# Altium schematic sheet 10.SchDoc
size 297 x 209 mm
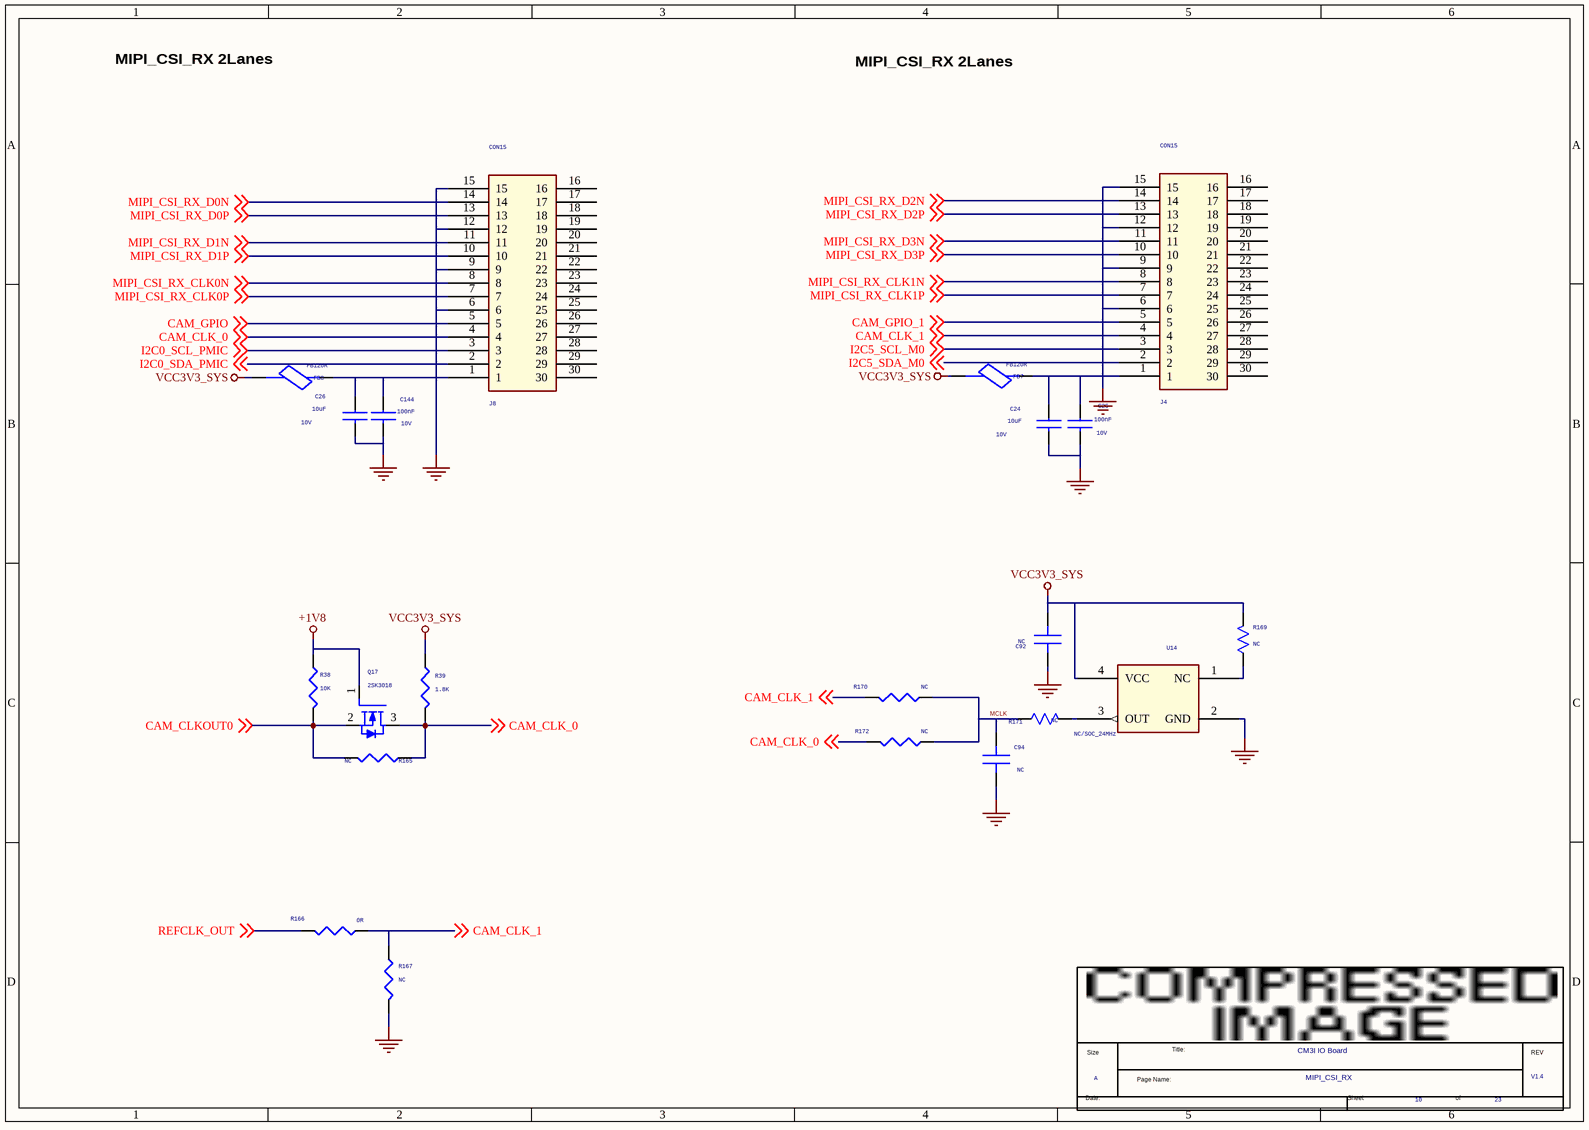
[diagram p0: 10.SchDoc]

## Parts
*  Page Count: 23  Page Number: 10  Page Size: A  Title: CM3I IO Board  RevCode: V1.4  Doc: MIPI_CSI_RX  (hidden comment: radxa_1010)  (graphical)
C24  10uF  Voltage: 10V  [C0603]
C25  100nF  Voltage: 10V  [C0402]
C26  10uF  Voltage: 10V  [C0603]
C92  NC  [C0402]
C94  NC  [C0402]
C144  100nF  Voltage: 10V  [C0402]
FB7  FB120R  [R0402]
FB8  FB120R  [R0402]
J4  CON15  [FPC15PIN-1.0MM-LS]
J8  CON15  [FPC15PIN-1.0MM-LS]
Q17  2SK3018  [SOT23]
R38  10K  [R0402]
R39  1.8K  [R0402]
R165  NC  [R0402]
R166  0R  [R0402]
R167  NC  [R0402]
R169  NC  [R0402]
R170  NC  [R0402]
R171  NC  [R0402]
R172  NC  [R0402]
U14  NC/SOC_24MHz  [CRY4_3R20X2R50X0R80]

## Nets
+1V8: Q17.1(GATE) R38.1
GND: C24.2 C25.2 C26.2 C92.2 C94.2 C144.2 J4.6 J4.9 J4.12 J4.15 J8.6 J8.9 J8.12 J8.15 R167.2 U14.2(GND)
VCC3V3_SYS: C92.1 FB7.1 FB8.1 R39.1 R169.2 U14.4(VCC)
CAM_CLK_0: J8.4 Q17.3(DRAIN) R39.2 R165.1 R172.2 ; off-sheet CAM_CLK_0
CAM_CLK_1: J4.4 R166.2 R167.1 R170.2 ; off-sheet CAM_CLK_1
CAM_CLKOUT0: Q17.2(SOURCE) R38.2 R165.2 ; off-sheet CAM_CLKOUT0
CAM_GPIO: J8.5 ; off-sheet CAM_GPIO
CAM_GPIO_1: J4.5 ; off-sheet CAM_GPIO_1
I2C0_SCL_PMIC: J8.3 ; off-sheet I2C0_SCL_PMIC
I2C0_SDA_PMIC: J8.2 ; off-sheet I2C0_SDA_PMIC
I2C5_SCL_M0: J4.3 ; off-sheet I2C5_SCL_M0
I2C5_SDA_M0: J4.2 ; off-sheet I2C5_SDA_M0
MCLK: C94.1 R170.1 R171.2 R172.1
MIPI_CSI_RX_CLK0N: J8.8 ; off-sheet MIPI_CSI_RX_CLK0N
MIPI_CSI_RX_CLK0P: J8.7 ; off-sheet MIPI_CSI_RX_CLK0P
MIPI_CSI_RX_CLK1N: J4.8 ; off-sheet MIPI_CSI_RX_CLK1N
MIPI_CSI_RX_CLK1P: J4.7 ; off-sheet MIPI_CSI_RX_CLK1P
MIPI_CSI_RX_D0N: J8.14 ; off-sheet MIPI_CSI_RX_D0N
MIPI_CSI_RX_D0P: J8.13 ; off-sheet MIPI_CSI_RX_D0P
MIPI_CSI_RX_D1N: J8.11 ; off-sheet MIPI_CSI_RX_D1N
MIPI_CSI_RX_D1P: J8.10 ; off-sheet MIPI_CSI_RX_D1P
MIPI_CSI_RX_D2N: J4.14 ; off-sheet MIPI_CSI_RX_D2N
MIPI_CSI_RX_D2P: J4.13 ; off-sheet MIPI_CSI_RX_D2P
MIPI_CSI_RX_D3N: J4.11 ; off-sheet MIPI_CSI_RX_D3N
MIPI_CSI_RX_D3P: J4.10 ; off-sheet MIPI_CSI_RX_D3P
REFCLK_OUT: R166.1 ; off-sheet REFCLK_OUT
NetC24_1: C24.1 C25.1 FB7.2 J4.1
NetC26_1: C26.1 C144.1 FB8.2 J8.1
NetR169_1: R169.1 U14.1(NC)
NetR171_1: R171.1 U14.3(OUT)

Not connected (* = marked no-connect by the designer): J4 16 17 18 19 20 21 22 23 24 25 26 27 28 29 30; J8 16 17 18 19 20 21 22 23 24 25 26 27 28 29 30

## Notes on the sheet
- MIPI_CSI_RX 2Lanes
- (in symbol radxa_1010) Title:; Size; REV; Page Name:; Date:; Sheet; of

## Library data of the parts
C24 C26 = CAP NP_0: cap,10.00uF,+/-10%,10V,X5R,C0603; Manufacturer: TDK; RK PN: C1608X5R1A106K080AC; Priority: A; Tolerance: 10%; Dielectric: X5R; Part Type: C0603; Manufacturer PN: C1608X5R1A106K080AC; Created by: JJJ
C25 = CAP NP_0: cap,100.00nF,+/-10%,10V,X5R,C0402; Manufacturer PN: C1005X5R1A104K050BA; Manufacturer: TDK; Tolerance: 10%; Priority: A; Dielectric: X5R; Created by: JJJ; Part Type: C0402; RK PN: C1005X5R1A104K050BA
C92 = C: 贴片陶瓷电容 0402 X5R 1uF±10% 16V; PARTS: 1; Part Number: 823030105005; OriginalSymbolOrigin: (0,30); PKG_TYPE: CAP2-100-250; LEVEL: STD; PINSWAP: (A,B); ROOM: DVDD_MEDIA; Grade: B; Approved: 已承认; Part Type: 电容
C94 = C: 贴片陶瓷电容 0402 NPO 10pF±5% 50V; PARTS: 1; Part Number: 823060100001; OriginalSymbolOrigin: (0,30); PKG_TYPE: CAP2-100-250; LEVEL: STD; PINSWAP: (A,B); Approved: 已承认; Grade: B; ROOM: AN41908; Part Type: 电容
C144 = CAP NP_0: cap,100.00nF,+/-10%,10V,X5R,C0402; Manufacturer: TDK; RK PN: C1005X5R1A104K050BA; Priority: A; Tolerance: 10%; Dielectric: X5R; Part Type: C0402; Manufacturer PN: C1005X5R1A104K050BA; Created by: JJJ
FB7 FB8 = FB: 贴片磁珠 0603 600Ω±25% 1000mA 铁氧体叠片 UPZ1608E601-1R0T 顺络; Part Number: 832026000003; Grade: D; Approved: 已承认; Part Type: 磁珠
J4 J8 = CON15_5
Q17 = MOSFET N: NMOS,2SK3018,SOT_323,Id=0.1A,Vds=30V; Manufacturer: ROHM; Rds: 5ohm; Priority: A; Id_max: 0.1A; Vgs: 20V; VDS: 30V; Vgsth: 1.5V; Pd: 0.2W; RK PN: 2SK3018; Part Type: NMOS; Manufacturer PN: 2SK3018; Created by: JJJ
R38 = RESISTOR_0_Dup4: 通用厚膜电阻,10K,+/-5%,R0402,1/16W.; Manufacturer: YAGEO; Tolerance: 5%; RK PN: RC0402JR-0710KL; Priority: A; Wattage: 1/16W; Part Type: 通用厚膜电阻; Manufacturer PN: RC0402JR-0710KL; Created by: YTL
R39 = RESISTOR_0_Dup4: 通用厚膜电阻,1K8,+/-5%,R0402,1/16W.; Manufacturer: YAGEO; Tolerance: 5%; RK PN: RC0402JR-071K8L; Priority: A; Wattage: 1/16W; Part Type: 通用厚膜电阻; Manufacturer PN: RC0402JR-071K8L; Created by: YTL
R165 R166 R170 R172 = RESISTOR_0_Dup1: 通用厚膜电阻,100R,+/-5%,R0402,1/16W.; Manufacturer: YAGEO; Tolerance: 5%; RK PN: RC0402JR-07100RL; Priority: A; Wattage: 1/16W; Part Type: 通用厚膜电阻; Manufacturer PN: RC0402JR-07100RL; Created by: YTL
R167 = RESISTOR_0_Dup1: 通用厚膜电阻,120R,+/-5%,R0402,1/16W.; Manufacturer PN: RC0402JR-07120RL; Manufacturer: YAGEO; Tolerance: 5%; Wattage: 1/16W; Priority: A; Created by: YTL; Part Type: 通用厚膜电阻; RK PN: RC0402JR-07120RL
R169 = R: 贴片电阻 0805 0Ω±5%; PARTS: 1; Part Number: 811040000001; LEVEL: STD; PKG_TYPE: 2; PINSWAP: (A,B); OriginalSymbolOrigin: (10,20); ROOM: DC-IRIS; Grade: B; Approved: 已承认; Part Type: 电阻
R171 = R: 贴片电阻 0402 33Ω±5%; PARTS: 1; Part Number: 811020330001; LEVEL: STD; PKG_TYPE: 2; PINSWAP: (A,B); OriginalSymbolOrigin: (10,20); Approved: 已承认; Grade: B; ROOM: AN41908; Part Type: 电阻
U14 = OSC_4PIN_1: 贴片钟振 27.000MHz ±30PPM  3.3V 3.2x2.5mm; Part Number: 841042700403; Grade: B; Approved: 已承认; ROOM: AN41908; Part Type: 钟振
* = radxa_1010: Page Create Date: March  8, 1995